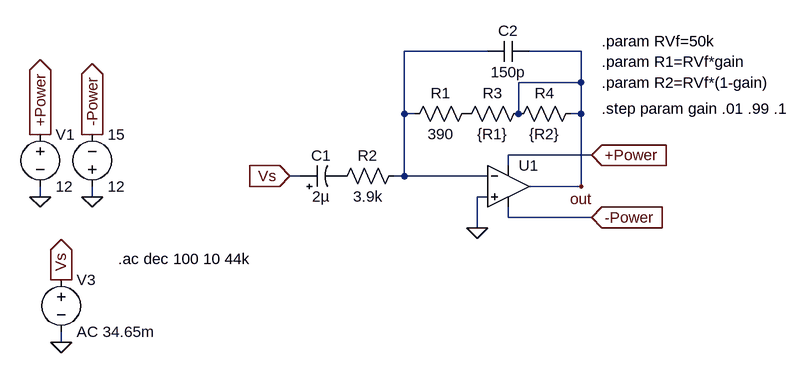
[diagram p0: schematic Preamp Freq.asc]
Preamp Freq.asc, the LTspice schematic file:
Version 4.1
SHEET 1 880 680
WIRE 192 -16 64 -16
WIRE 336 -16 256 -16
WIRE 336 32 336 -16
WIRE 336 32 240 32
WIRE 64 80 64 -16
WIRE 80 80 64 80
WIRE 240 80 240 32
WIRE 336 80 336 32
WIRE 336 80 320 80
WIRE 352 144 224 144
WIRE 224 160 224 144
WIRE -96 176 -112 176
WIRE 64 176 64 80
WIRE 64 176 48 176
WIRE 192 176 64 176
WIRE 336 192 336 80
WIRE 336 192 256 192
WIRE -496 208 -496 192
WIRE -416 208 -416 192
WIRE 192 208 176 208
WIRE 224 240 224 224
WIRE 352 240 224 240
WIRE 176 256 176 208
WIRE -464 432 -464 416
FLAG 352 144 +Power
IOPIN 352 144 In
FLAG 352 240 -Power
IOPIN 352 240 In
FLAG 176 256 0
FLAG -496 112 +Power
IOPIN -496 112 Out
FLAG -416 112 -Power
IOPIN -416 112 Out
FLAG -496 208 0
FLAG -416 208 0
FLAG -112 176 Vs
IOPIN -112 176 In
FLAG -464 336 Vs
IOPIN -464 336 Out
FLAG -464 432 0
FLAG 336 192 out
SYMBOL OpAmps\\UniversalOpAmp 224 192 R0
SYMATTR InstName U1
SYMBOL res 176 64 R90
WINDOW 0 0 56 VBottom 2
WINDOW 3 32 56 VTop 2
SYMATTR InstName R1
SYMATTR Value 390
SYMBOL res 64 160 R90
WINDOW 0 0 56 VBottom 2
WINDOW 3 32 56 VTop 2
SYMATTR InstName R2
SYMATTR Value 3.9k
SYMBOL voltage -496 96 R0
WINDOW 123 0 0 Left 0
WINDOW 39 0 0 Left 0
SYMATTR InstName V1
SYMATTR Value 12
SYMBOL voltage -416 208 M180
WINDOW 123 0 0 Left 0
WINDOW 39 0 0 Left 0
SYMATTR InstName 12
SYMATTR Value 15
SYMBOL voltage -464 320 R0
WINDOW 123 0 0 Left 0
WINDOW 39 0 0 Left 0
SYMATTR InstName V3
SYMATTR Value AC 34.65m
SYMBOL polcap -96 192 R270
WINDOW 0 32 32 VTop 2
WINDOW 3 0 32 VBottom 2
SYMATTR InstName C1
SYMATTR Value 2µ
SYMBOL cap 256 -32 R90
WINDOW 0 0 32 VBottom 2
WINDOW 3 32 32 VTop 2
SYMATTR InstName C2
SYMATTR Value 150p
SYMBOL res 256 64 R90
WINDOW 0 0 56 VBottom 2
WINDOW 3 32 56 VTop 2
SYMATTR InstName R3
SYMATTR Value {R1}
SYMBOL res 336 64 R90
WINDOW 0 0 56 VBottom 2
WINDOW 3 32 56 VTop 2
SYMATTR InstName R4
SYMATTR Value {R2}
TEXT 368 -32 Left 2 !.param RVf=50k
TEXT 368 0 Left 2 !.param R1=RVf*gain
TEXT 368 72 Left 2 !.step param gain .01 .99 .1
TEXT 368 32 Left 2 !.param R2=RVf*(1-gain)
TEXT -376 304 Left 2 !.ac dec 100 10 44k

The netlist it stands for:
* Preamp Freq.asc
X§U1 0 N001 +Power -Power out level1 Avol=1Meg GBW=10Meg Vos=0 En=0 Enk=0 In=0 Ink=0 Rin=500Meg  ; pins In+ In- V+ V- OUT
R1 P001 N001 390
R2 N001 P002 3.9k
V1 +Power 0 12
V§12 0 -Power 15
V3 Vs 0 AC 34.65m
C1 Vs P002 2µ
C2 out N001 150p
R3 out P001 {R1}
R4 out out {R2}
.param RVf=50k
.param R1=RVf*gain
.step param gain .01 .99 .1
.param R2=RVf*(1-gain)
.ac dec 100 10 44k
.lib UniversalOpAmp1.lib
.backanno
.end